# EAGLE design bluetooth (EAGLE 9.6.2)
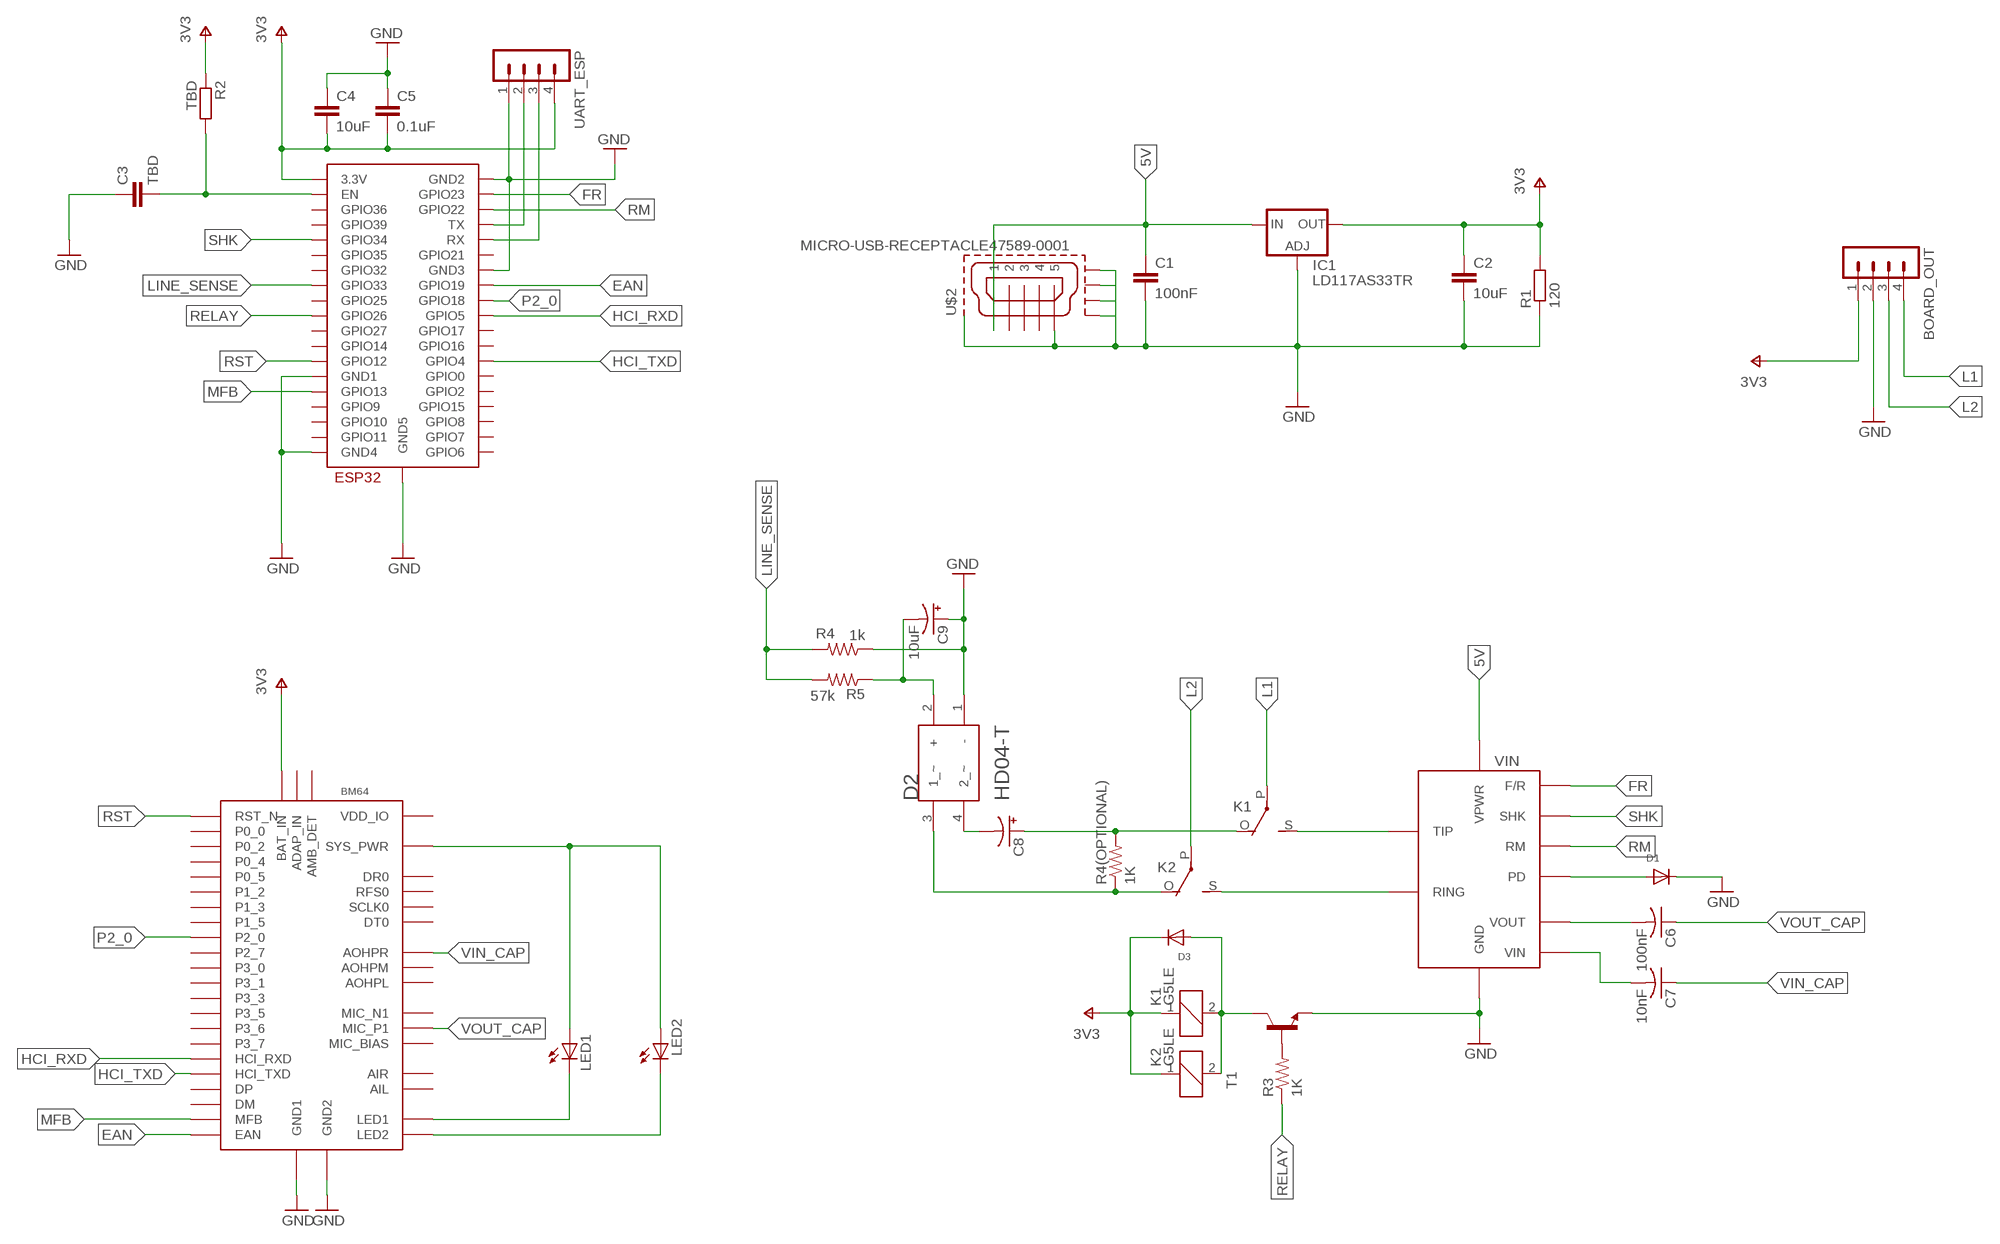
[diagram p0: schematic, sheet 1]

## Parts
BM64  DJD_EAGLE_LIBRARY_BM64  [DJD_EAGLE_LIBRARY_BM64]
BOARD_OUT  MA04-1  [MA04-1]
C1  100nF  C-EUC0805  [C0805]
C2  10uF  C-EUC0805  [C0805]
C3  TBD  C-EUC0805  [C0805]
C4  10uF  C-EUC0805  [C0805]
C5  0.1uF  C-EUC0805  [C0805]
C6  100nF  C-USC0805  [C0805]
C7  10nF  C-USC0805  [C0805]
C8  CPOL-USE2-5  [E2-5]
C9  10uF  10UF-POLAR-RADIAL-2.5MM-25V-20%  [CPOL-RADIAL-2.5MM-5MM]
D1  DIODESMA  [SMADIODE]
D2  DIODES_HD04-TDIODES_HD04-T_0_0  [DIODES_HD04-T_0]
D3  DIODESOD-123  [SOD-123]
IC1  LD117AS33TR  [SOT223]
K1  G5LE  [G5LE]
K2  G5LE  [G5LE]
LED1  LEDCHIP-LED0805  [CHIP-LED0805]
LED2  LEDCHIP-LED0805  [CHIP-LED0805]
R1  120  R-EU_M0805  [M0805]
R2  TBD  R-EU_M0805  [M0805]
R3  1K  R-US_M0805  [M0805]
R4  1k  R-US_M0805  [M0805]
R4(OPTIONAL)  1K  R-US_M0805  [M0805]
R5  57k  R-US_M0805  [M0805]
T1  -NPN-SOT23-EBC  [SOT23-EBC]
U$1  ESP32-WROOM  [ESP32-WROOM]
U$2  MICRO-USB-RECEPTACLE47589-0001  [47589-0001]
UART_ESP  MA04-1  [MA04-1]
VIN  DJD_EAGLE_LIBRARY_AG1171SIL  [DJD_EAGLE_LIBRARY_AG1171]

## Nets
5V: C1.1 IC1.3(IN) U$2.1 VIN.P$13(VPWR)
CRANK_LOAD_1: C8.+ K1.O(2:O) R4(OPTIONAL).2
CRANK_LOAD_2: D2.3(1_~) K2.O(2:O) R4(OPTIONAL).1
EAN: BM64.32(EAN) U$1.IO19(GPIO19)
ESP_EN: C3.2 R2.2 U$1.EN
ESP_RX: U$1.RX UART_ESP.3
ESP_TX: U$1.TX UART_ESP.2
FR: U$1.IO23(GPIO23) VIN.P$3(F/R)
GND: BM64.14(GND1) BM64.43(GND2) BOARD_OUT.2 C1.2 C2.2 C3.1 C4.1 C5.1 C9.1(+) D1.C D2.1(-) IC1.1(ADJ) R1.1 R4.1 T1.E U$1.GND1 U$1.GND2 U$1.GND3 U$1.GND4 U$1.GND5 U$2.5 U$2.CASING1(GND1) U$2.CASING2(GND2) U$2.CASING3(GND3) U$2.CASING4(GND4) UART_ESP.1 VIN.P$12(GND)
HCI_RXD: BM64.19(HCI_RXD) U$1.IO5(GPIO5)
HCI_TXD: BM64.20(HCI_TXD) U$1.IO4(GPIO4)
L1: BOARD_OUT.4 K1.P(2:P)
L2: BOARD_OUT.3 K2.P(2:P)
LED1: BM64.28(LED1) LED1.C
LED2: BM64.27(LED2) LED2.C
LINE_RELAY_1: K1.S(2:S) VIN.P$2(TIP)
LINE_RELAY_2: K2.S(2:S) VIN.P$1(RING)
LINE_SENSE: R4.2 R5.2 U$1.IO33(GPIO33)
MFB: BM64.26(MFB) U$1.IO13(GPIO13)
N$5: R3.2 T1.B
N$12: C8.- D2.4(2_~)
N$14: C9.2(-) D2.2(+) R5.1
P2_0: BM64.41(P2_0) U$1.IO18(GPIO18)
POWER_DOWN: D1.A VIN.P$14(PD)
RELAY: R3.1 U$1.IO26(GPIO26)
RELAY_DRIVE: D3.A K1.2 K2.2 T1.C
RM: U$1.IO22(GPIO22) VIN.P$4(RM)
RST: BM64.13(RST_N) U$1.IO12(GPIO12)
SHK: U$1.IO34(GPIO34) VIN.P$5(SHK)
SYS_PWR: BM64.24(SYS_PWR) LED1.A LED2.A
V+: BM64.22(BAT_IN) BOARD_OUT.1 C2.1 C4.2 C5.2 D3.C IC1.4(OUT) K1.1 K2.1 R1.2 R2.1 U$1.3V3(3.3V) UART_ESP.4 ; supply symbol labelled 3V3
VIN: C7.2 VIN.P$9(VIN)
VIN_CAP: BM64.5(AOHPR) C7.1
VOUT: C6.2 VIN.P$10(VOUT)
VOUT_CAP: BM64.9(MIC_P1) C6.1
Unconnected: BM64.1(DR0) BM64.2(RFS0) BM64.3(SCLK0) BM64.4(DT0) BM64.6(AOHPM) BM64.7(AOHPL) BM64.8(MIC_N1) BM64.10(MIC_BIAS) BM64.11(AIR) BM64.12(AIL) BM64.15(P1_2) BM64.16(P1_3) BM64.17(P0_4) BM64.18(P1_5) BM64.21(VDD_IO) BM64.25(AMB_DET) BM64.29(P3_7) BM64.30(P3_5) BM64.31(P0_0) BM64.33(DM) BM64.34(DP) BM64.35(P0_5) BM64.36(P3_0) BM64.37(P3_1) BM64.38(P3_3) BM64.39(P3_6) BM64.40(P0_2) BM64.42(P2_7) U$1.CLK(GPIO6) U$1.CMD(GPIO11) U$1.IO0(GPIO0) U$1.IO2(GPIO2) U$1.IO14(GPIO14) U$1.IO15(GPIO15) U$1.IO16(GPIO16) U$1.IO17(GPIO17) U$1.IO21(GPIO21) U$1.IO25(GPIO25) U$1.IO27(GPIO27) U$1.IO32(GPIO32) U$1.IO35(GPIO35) U$1.SD0(GPIO7) U$1.SD1(GPIO8) U$1.SD2(GPIO9) U$1.SD3(GPIO10) U$1.SENSOR_VN(GPIO39) U$1.SENSOR_VP(GPIO36) U$2.2 U$2.3 U$2.4

## Power pins joined to a net without a drawn wire
ADAP_IN: BM64.23(ADAP_IN)

## Library data of the parts
BM64 = blue_pot_proto:DJD_EAGLE_LIBRARY_BM64: Microchip BM64 Bluetooth Module
BOARD_OUT UART_ESP = con-lstb:MA04-1: PIN HEADER; OC_FARNELL: unknown; OC_NEWARK: unknown
C1-C5 = rcl:C-EU: CAPACITOR, European symbol; SPICEPREFIX: C
C6 C7 = adafruit:C-US: CAPACITOR, American symbol
C8 = adafruit:CPOL-US: POLARIZED CAPACITOR, American symbol
C9 = SparkFun-Capacitors:10UF-POLAR: 10.0µF polarized capacitors A capacitor is a passive two-terminal electrical component used to store electrical energy temporarily in an electric field.; PROD_ID: CAP-08440
D1 D3 = adafruit:DIODE: Diode SMADIODE - SMA Surface Mount Package 20V 1A Schottky Diode Digikey: 641-1014-6-ND DO-1N4148 - Through Hole Small Current Diode SOD-123 20V 1 A (.5mV Vf) Schottky Diode - Digikey: MBRX120TPMSCT-ND SOD-323 10V 570mA (.38mV Vf, 3ns) Schottky Diode - Digikey: ZLLS410CT-ND SOD-523 30V 30mA Schottky Diode (RB751S-40TE61) - Digikey: RB751S-40TE61CT-ND SOT23-R/W - SOT23 Package (R = Solder Paste/Reflow Ovens, W = Hand-Soldering) BAT54Film 40V 300mA - Digikey: 497-7162-1-ND
D2 = Diodes - HD04-T:DIODES_HD04-T: 0.8A SURFACE MOUNT GLASS PASSIVATED BRIDGE RECTIFIER; CENTROID_NOT_SPECIFIED: No; DATASHEET: https://www.diodes.com/assets/Datasheets/ds17003.pdf; DC_BLOCKING_VOLTAGE: 400V; DEVICE_CLASS_L1: Discrete Semiconductors; DEVICE_CLASS_L2: Diodes; DEVICE_CLASS_L3: Rectifier Diodes; DIGIKEY_DESCRIPTION: DIODE RECT BRIDGE GP 400V 0.8A MINIDIP; DIGIKEY_PART_NUMBER: HD04DICT-ND; FOOTPRINT_URL: https://www.diodes.com/assets/Package-Files/MiniDIP.pdf; FOOTPRINT_VARIANT_NAME_0: Recommended_Land_Pattern; FORWARD_CURRENT: 0.8A; HEIGHT: 3mm; LEAD_FREE: yes; MAX_REPETITIVE_REVERSE_VOLTAGE: 400V; MAX_SURGE_FORWARD_CURRENT: 30A; MF: Diodes; MFG_PACKAGE_IDENT: MiniDIP; MFG_PACKAGE_IDENT_DATE: 06/2017; MFG_PACKAGE_IDENT_REV: 0; MOUSER_DESCRIPTION: Bridge Rectifiers 400V 0.8A; MOUSER_PART_NUMBER: 621-HD04T; MPN: HD04-T; PACKAGE: MiniDIP-4; PEAK_REVERSE_CURRENT: 500uA; PREFIX: D; REVERSE_VOLTAGE: 280V; ROHS: yes; STANDOFF_HEIGHT: 0.2mm; TEMPERATURE_RANGE_HIGH: +150°C; TEMPERATURE_RANGE_LOW: -55°C; VERIFICATION_VERSION: 0.0.0.1; WORKING_REVERSE_VOLTAGE: 400V
IC1 = v-reg:LD117A?*: Low drop fixed and adjustable positive voltage regulators 1 A Source: http://www.st.com/stonline/products/literature/ds/7194/ld1117axx.pdf
K1 K2 = relay:G5LE: RELAY 1 x switch, 10 A/120 V AC, 8 A/30 V DC, Omron; OC_FARNELL: unknown; OC_NEWARK: unknown
LED1 LED2 = adafruit:LED: LED OSRAM: - CHIPLED LG R971, LG N971, LY N971, LG Q971, LY Q971, LO R971, LY R971 LH N974, LH R974 LS Q976, LO Q976, LY Q976 LO Q996 - Hyper CHIPLED LW Q18S LB Q993, LB Q99A, LB R99A - SideLED LS A670, LO A670, LY A670, LG A670, LP A670 LB A673, LV A673, LT A673, LW A673 LH A674 LY A675 LS A676, LA A676, LO A676, LY A676, LW A676 LS A679, LY A679, LG A679 - Hyper Micro SIDELED® LS Y876, LA Y876, LO Y876, LY Y876 LT Y87S - SmartLED LW L88C, LW L88S LB L89C, LB L89S, LG L890 LS L89K, LO L89K, LY L89K LS L896, LA L896, LO L896, LY L896 - TOPLED LS T670, LO T670, LY T670, LG T670, LP T670 LSG T670, LSP T670, LSY T670, LOP T670, LYG T670 LG T671, LOG T671, LSG T671 LB T673, LV T673, LT T673, LW T673 LH T674 LS T676, LA T676, LO T676, LY T676, LB T676, LH T676, LSB T676, LW T676 LB T67C, LV T67C, LT T67C, LS T67K, LO T67K, LY T67K, LW E67C LS E67B, LA E67B, LO E67B, LY E67B, LB E67C, LV E67C, LT E67C LW T67C LS T679, LY T679, LG T679 LS T770, LO T770, LY T770, LG T770, LP T770 LB T773, LV T773, LT T773, LW T773 LH T774 LS E675, LA E675, LY E675, LS T675 LS T776, LA T776, LO T776, LY T776, LB T776 LHGB T686 LT T68C, LB T68C - Hyper Mini TOPLED® LB M676 - Mini TOPLED Santana® LG M470 LS M47K, LO M47K, LY M47K Source: http://www.osram.convergy.de/
R1 R2 = rcl:R-EU_: RESISTOR, European symbol; SPICEPREFIX: R
R3 R4 R4(OPTIONAL) R5 = adafruit:R-US_: RESISTOR, American symbol
T1 = transistor:*-NPN-: NPN Transistror BF959 corrected 2008.03.06
U$1 = ESP32:ESP32-WROOM
U$2 = con-molex-usb:MICRO-USB-RECEPTACLE: MICRO USB RECEPTACLES Micro-USB Receptacles, SMT, Lead-Free from MOLEX <http://www.molex.com/>. (C) 2014 Tomasz Boleslaw CEDRO, cederom@tlen.pl, http://www.tomek.cedro.info. Version 0.1 (2014-01-17): Initial release. Version 0.2 (2014-02-06): Updated 47589-0001 footprint pins/pads/milling. Following devices are included: 1. 47589-0001 Micro-USB AB Receptacle, Bottom Mount, SMT, Lead-Free <http://www.molex.com/molex/products/datasheet.jsp?part=active/0475890001_IO_CONNECTORS.xml> (Technical Drawing <http://www.molex.com/pdm_docs/sd/475890001_sd.pdf>).
VIN = blue_pot_proto:DJD_EAGLE_LIBRARY_AG1171: Silvertel AG1171 +3.3V / +5.0V Low Power Ringing SLIC

## Net classes
0 default: width 0.381 mm
1 large: width 0.254 mm

## Board
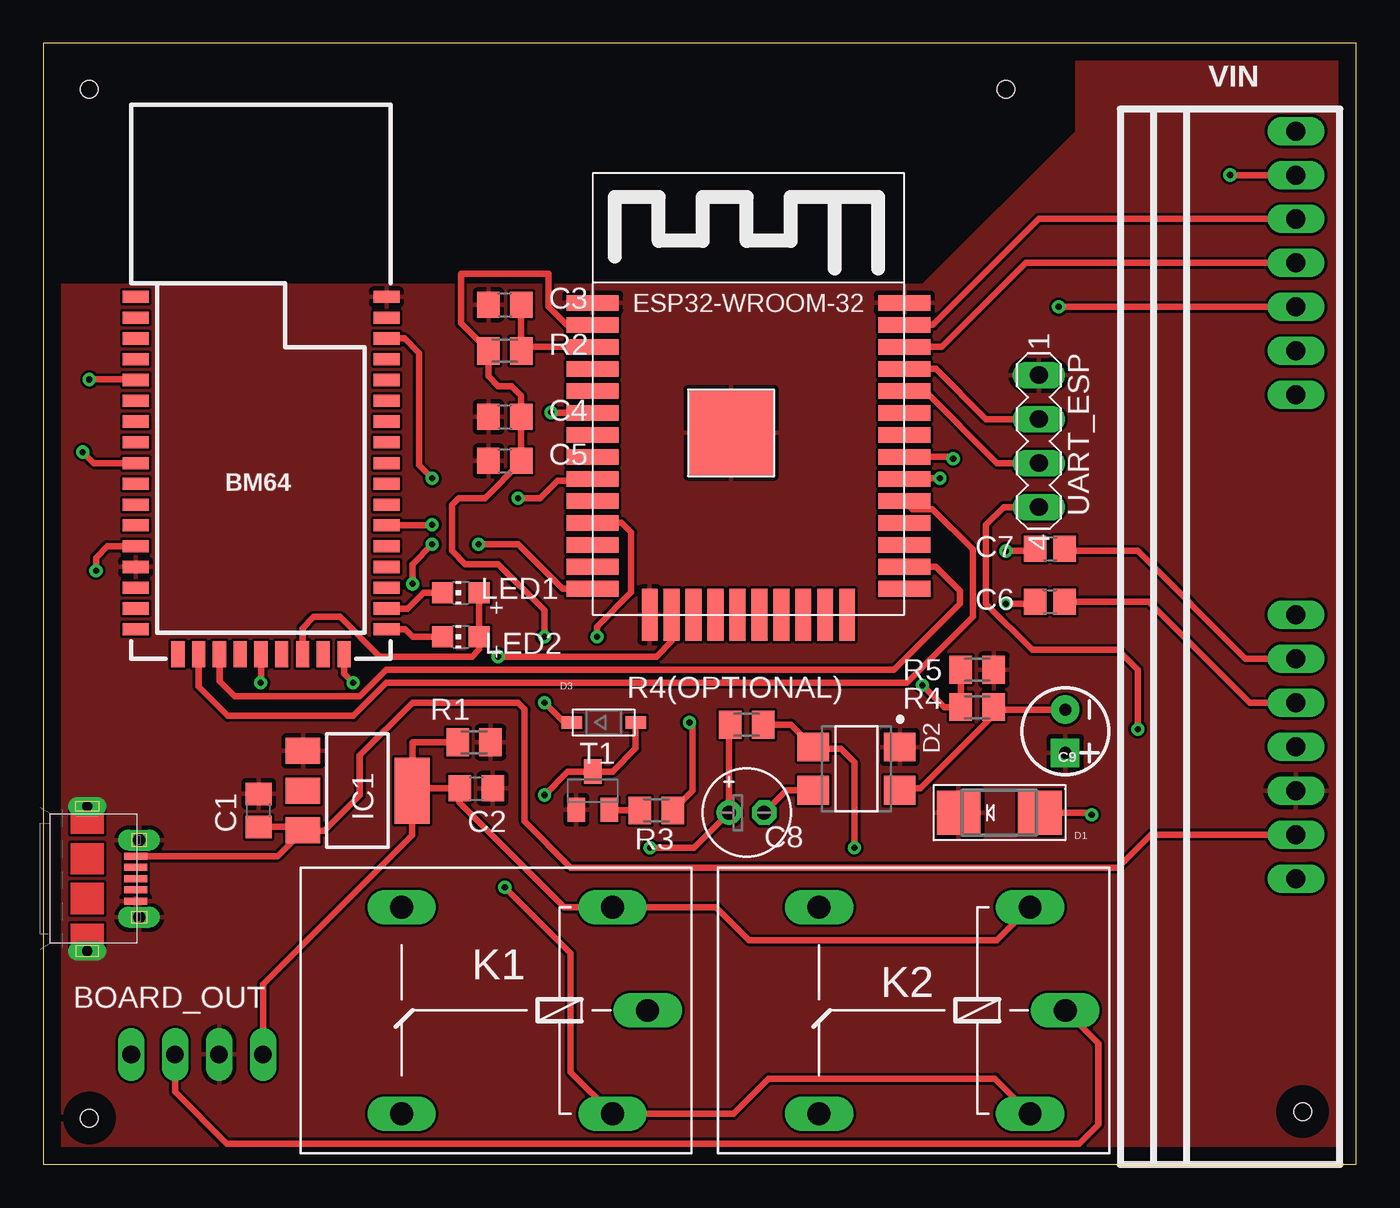
[diagram p1: board, top side]
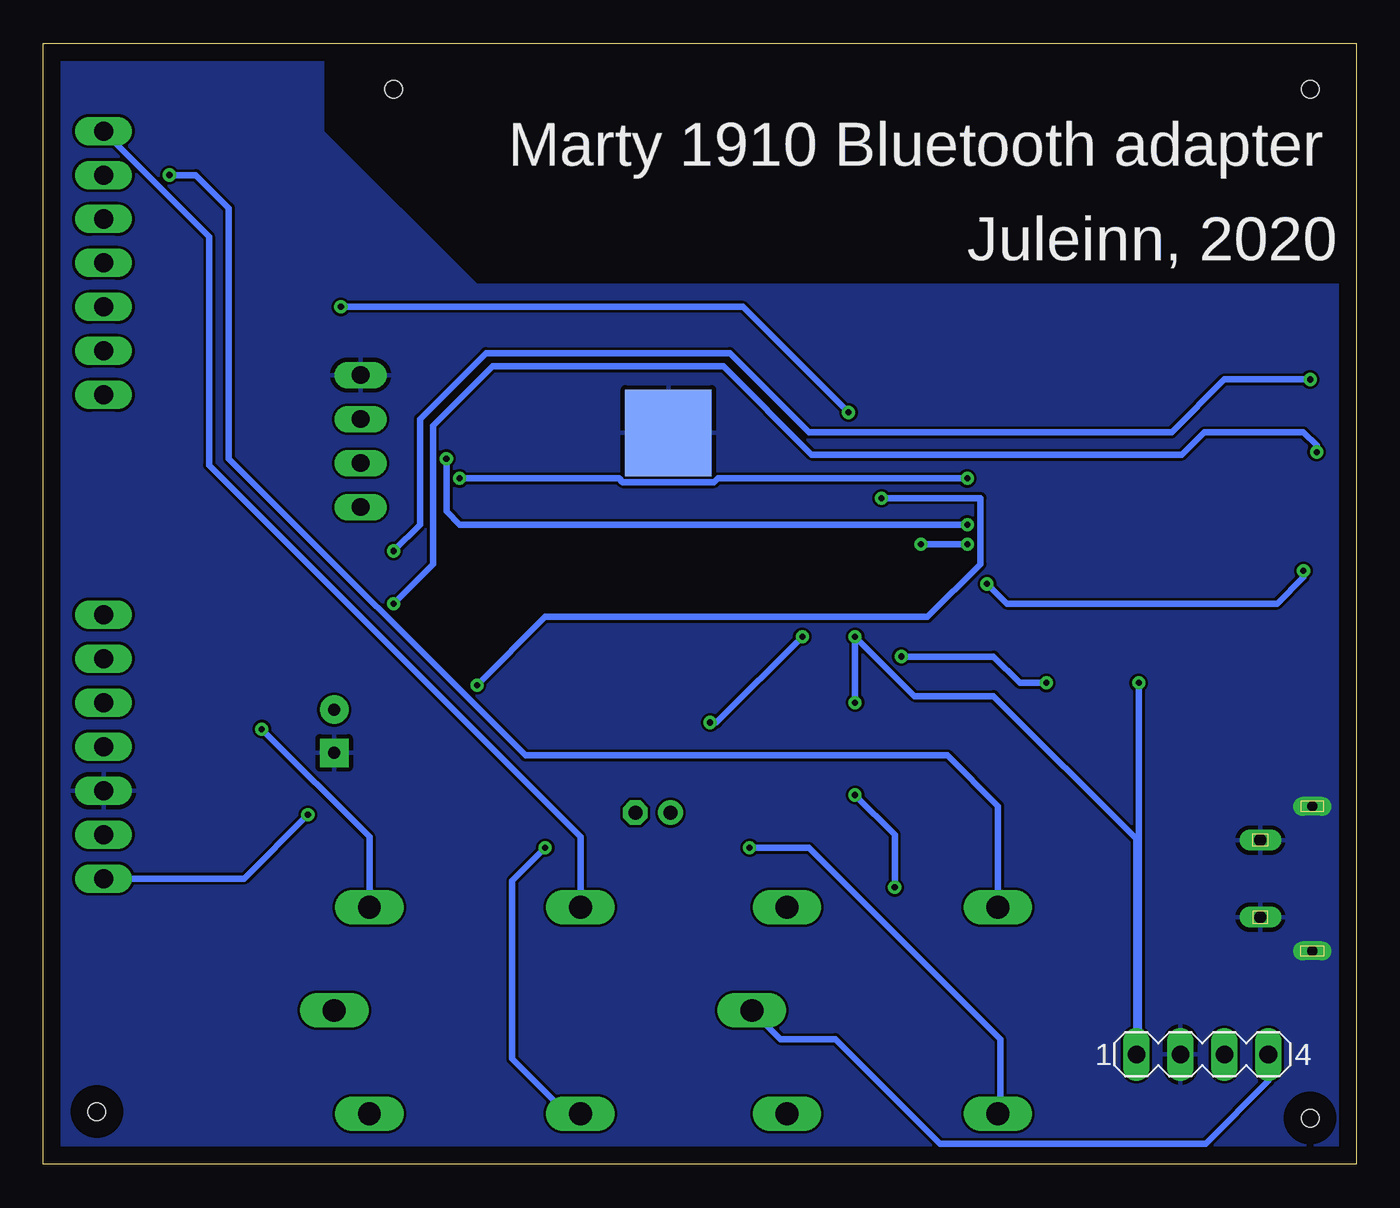
[diagram p2: board, bottom side, seen from below]

Size 75.87 x 64.76 mm. Coordinates in mm from the lower left corner, seen from the top.
Outline: 0,0 75.87,0 75.87,64.76 0,64.76 0,0
Copper layers (1*16): Top 0.035mm / dielectric 1.5mm / Bottom 0.035mm
Design rules "default": minimum track width 6mil, minimum drill 0.35mm, track to track 6mil, track to pad 6mil, pad to pad 6mil, via to via 6mil, smd to smd 6mil, copper to edge 40mil, drill to drill 6mil, minimum pad ring 10mil, minimum via ring 8mil, stop-mask expansion 4mil, vias tented up to drill 0mil, thermal gap 10mil
Holes 1 mm at 2.67,2.67 2.67,62.1 72.77,3.05 55.63,62.1

### Footprints (pad centres in the part's own frame; a part is rotated, then mirrored left to right if it is on the bottom)
DJD_EAGLE_LIBRARY_BM64 = smd 1.5 x 0.7: 1 0.25,20.9; 2 0.25,19.7; 3 0.25,18.5; 4 0.25,17.3; 5 0.25,16.1; 6 0.25,14.9; 7 0.25,13.7; 8 0.25,12.5; 9 0.25,11.3; 10 0.25,10.1; 11 0.25,8.9; 12 0.25,7.7; 13 0.25,6.5; 14 0.25,5.3; 15 0.25,4.1; 16 0.25,2.9; 17 0.25,1.7; 27 14.75,1.7; 28 14.75,2.9; 29 14.75,4.1; 30 14.75,5.3; 31 14.75,6.5; 32 14.75,7.7; 33 14.75,8.9; 34 14.75,10.1; 35 14.75,11.3; 36 14.75,12.5; 37 14.75,13.7; 38 14.75,14.9; 39 14.75,16.1; 40 14.75,17.3; 41 14.75,18.5; 42 14.75,19.7; 43 14.75,20.9 | smd 0.76 x 1.5: 18 2.7,0.25; 19 3.9,0.25; 20 5.1,0.25; 21 6.3,0.25; 22 7.5,0.25; 23 8.7,0.25; 24 9.9,0.25; 25 11.1,0.25; 26 12.3,0.25
MA04-1 = drill 1.016 long: 1 -3.81,0; 2 -1.27,0; 3 1.27,0; 4 3.81,0
C0805 = smd 1.3 x 1.5: 1 -0.95,0; 2 0.95,0
C0805' = smd 1.3 x 1.5: 1 -0.85,0; 2 0.85,0
E2-5 = drill 0.813 pad 1.422: + -1.016,0 | drill 0.813 pad 1.422 octagon: - 1.016,0
CPOL-RADIAL-2.5MM-5MM = drill 0.7 pad 1.651 square: 1 1.25,0 | drill 0.7 pad 1.651: 2 -1.25,0
SMADIODE = smd 2.54 x 2.54: A 2.349,0; C -2.349,0
DIODES_HD04-T_0 = smd 1.65 x 1.8: 1 -1.25,2.5; 2 1.25,2.5; 3 -1.25,-2.5; 4 1.25,-2.5
SOD-123 = smd 1.2 x 0.7: A 1.85,0; C -1.85,0
SOT223 = smd 1.5 x 2: 1 -2.3,-3.15; 2 0,-3.15; 3 2.3,-3.15 | smd 3.8 x 2: 4 0,3.15
G5LE = drill 1.321 long: 1 -7.493,-5.969; 2 -7.493,5.969; O 4.699,5.969; P -9.525,0; S 4.699,-5.969
CHIP-LED0805 = smd 1.2 x 1.2: A 0,-1.05; C 0,1.05
M0805 = smd 1.3 x 1.6: 1 -0.95,0; 2 0.95,0
SOT23-EBC = smd 1 x 1.4: B 0.95,-1.1; C 0,1.1; E -0.95,-1.1
ESP32-WROOM = smd 3 x 0.9: 3V3 0,16.74; EN 0,15.47; GND1 0,18.01; GND3 18,18.01; IO0 18,1.5; IO4 18,2.77; IO5 18,6.58; IO12 0,1.5; IO14 0,2.77; IO16 18,4.04; IO17 18,5.31; IO18 18,7.85; IO19 18,9.12; IO21 18,11.66; IO22 18,15.47; IO23 18,16.74; IO25 0,6.58; IO26 0,5.31; IO27 0,4.04; IO32 0,9.12; IO33 0,7.85; IO34 0,11.66; IO35 0,10.39; NC 18,10.39; RX 18,12.93; SENSOR_VN 0,12.93; SENSOR_VP 0,14.2; TX 18,14.2 | smd 0.9 x 3: CLK 9.635,0; CMD 8.365,0; GND2 3.285,0; IO2 14.715,0; IO13 4.555,0; IO15 13.445,0; SD0 10.905,0; SD1 12.175,0; SD2 5.825,0; SD3 7.095,0 | smd 5 x 5: GND4 8,10.5 | smd 5 x 5 bottom: GND5 8,10.5
47589-0001 = smd 1.35 x 0.4: 1 2.8,1.3; 2 2.8,0.65; 3 2.8,0; 4 2.8,-0.65; 5 2.8,-1.3 | drill 0.6 pad 0.95 long: CASING1 0,4.175; CASING2 0,-4.175 | drill 0.7 pad 1.1 long: CASING3 3,2.225; CASING4 3,-2.225
DJD_EAGLE_LIBRARY_AG1171 = drill 1.1 long: P$1 0,30.48; P$2 0,27.94; P$3 0,25.4; P$4 0,22.86; P$5 0,20.32; P$6 0,17.78; P$7 0,15.24; P$8 0,2.54; P$9 0,0; P$10 0,-2.54; P$11 0,-5.08; P$12 0,-7.62; P$13 0,-10.16; P$14 0,-12.7

### Placement (x,y rotation side)
BM64  5.08,29.21 0 top
BOARD_OUT  8.89,6.35 0 bottom
C1  12.45,20.45 90 top
C2  25.02,21.72 0 top
C3  26.67,49.66 0 top
C4  26.67,43.18 0 top
C5  26.67,40.64 0 top
C6  100nF  [C0805']  58.17,32.51 0 top
C7  10nF  [C0805']  58.17,35.56 0 top
C8  40.64,20.32 0 top
C9  59.05,25.02 270 top
D1  55.24,20.32 0 top
D2  46.99,22.86 270 top
D3  32.38,25.53 0 top
IC1  18.16,21.59 270 top
K1  25.4,8.89 180 top
K2  49.53,8.89 180 top
LED1  24.13,33.02 90 top
LED2  24.13,30.48 90 top
R1  24.89,24.38 180 top
R2  26.67,46.99 0 top
R3  35.43,20.45 180 top
R4  53.98,28.57 180 top
R4(OPTIONAL)  40.64,25.4 180 top
R5  53.98,26.42 180 top
T1  31.75,21.59 0 top
U$1  31.75,31.75 0 top
U$2  2.54,16.51 0 top
UART_ESP  57.53,41.78 270 top
VIN  72.39,29.21 0 top

### Tracks (layer width: path | path; a pad name or v marks a point on that pad's centre or on a via)
5V
  Top 0.381: U$2.1 13.53,17.81 IC1.3 | IC1.3 | IC1.3 16.24,19.29 18.29,21.34 18.29,23.62 21.34,26.67 27.43,26.67 27.81,26.29 27.81,19.81 30.48,17.14 62.1,17.14 64.01,19.05 VIN.P$13 | C1.1 14.79,19.5 IC1.3
CRANK_LOAD_1  (via drill 0.35)
  Top 0.381: R4(OPTIONAL).2 39.62,25.33 C8.+ 37.59,18.29 v35.05,18.29
  Bottom 0.381: K1.O 20.57,3.05 20.57,7.24 31.62,18.29 v35.05,18.29
CRANK_LOAD_2  (via drill 0.35)
  Top 0.381: R4(OPTIONAL).1 43.2,25.4 D2.3 44.6,24 46.1,24 46.86,23.24 v46.86,18.29
  Bottom 0.381: v46.86,18.29 48.77,16.38 48.77,6.1 45.59,2.92 K2.O
EAN  (via drill 0.35)
  Top 0.381: U$1.IO19 52.48,40.87 v52.58,40.77 | v22.48,36.96 22.43,36.91 BM64.32
  Bottom 0.381: v52.58,40.77 52.58,37.72 51.82,36.96 v22.48,36.96
ESP_EN
  Top 0.381: C3.2 R2.2 27.85,47.22 U$1.EN
ESP_RX
  Top 0.381: U$1.RX 50.95,44.68 55.12,40.51 UART_ESP.3
ESP_TX
  Top 0.381: U$1.TX 51.59,45.95 54.48,43.05 UART_ESP.2
FR
  Top 0.381: VIN.P$3 57.53,54.61 51.41,48.49 U$1.IO23
GND
  pour Top: 0,50.8 50.8,50.8 59.69,59.69 59.69,64.77 76.2,64.77 76.2,0 0,0
  pour Bottom: 0,50.8 0,0 76.2,0 76.2,64.77 59.69,64.77 59.69,59.69 50.8,50.8
HCI_RXD
  Top 0.381: U$1.IO5 50.23,37.85 51.39,37.85 53.72,35.52 53.72,31.62 49.91,27.81 19.81,27.81 17.91,25.91 10.67,25.91 8.98,27.6 BM64.19
HCI_TXD
  Top 0.381: U$1.IO4 51.59,34.52 52.96,33.15 52.96,32.38 49.15,28.57 19.81,28.57 18.29,27.05 11.05,27.05 10.18,27.92 BM64.20
L1
  Bottom 0.381: K1.P 33.27,7.24 30.1,7.24 24.07,1.21 8.7,1.21 5.08,4.83 BOARD_OUT.4
L2
  Top 0.381: K2.P 60.96,6.99 60.96,2.29 59.88,1.21 10.6,1.21 7.62,4.19 BOARD_OUT.3
LED1
  Top 0.381: BM64.28 21.06,32.11 21.97,33.02 LED1.C
LED2
  Top 0.381: BM64.27 20.91,30.91 21.34,30.48 LED2.C
LINE_RELAY_1  (via drill 0.35)
  Top 0.381: VIN.P$2 v68.58,57.15
  Bottom 0.381: v68.58,57.15 67.06,57.15 65.15,55.24 65.15,40.77 48.01,23.62 23.62,23.62 20.7,20.7 K1.S
LINE_RELAY_2
  Bottom 0.381: VIN.P$1 66.29,53.59 66.29,40.39 44.83,18.92 K2.S
LINE_SENSE  (via drill 0.35)
  Top 0.381: R4.2 R5.2 52.07,26.42 v50.8,27.68 | U$1.IO33 31.65,39.5 29.73,39.5 28.7,38.48 v27.43,38.48
  Bottom 0.381: v50.8,27.68 46.86,31.62 24.77,31.62 21.72,34.67 21.72,38.48 v27.43,38.48
MFB  (via drill 0.35)
  Top 0.381: U$1.IO13 36.3,30.21 35.43,29.34 v26.29,29.34 | v17.91,27.81 17.38,28.34 BM64.26
  Bottom 0.381: v17.91,27.81 19.43,27.81 20.95,29.34 v26.29,29.34
N$5
  Top 0.381: R3.2 32.74,20.45 T1.B
N$12
  Top 0.381: C8.- 42.95,21.61 D2.4
N$14
  Top 0.381: D2.2 49.6,21.72 50.67,21.72 54.92,25.97 R5.1 55.07,26.27 C9.2
P2_0  (via drill 0.35)
  Top 0.381: U$1.IO18 49.77,39.62 v51.82,39.62 | v22.48,39.62 21.72,40.39 21.72,46.86 20.87,47.71 BM64.41
  Bottom 0.381: v51.82,39.62 42.61,39.62 42.39,39.41 37.11,39.41 36.89,39.62 v22.48,39.62
POWER_DOWN  (via drill 0.35)
  Top 0.381: D1.A 60.45,20.32 v60.58,20.19
  Bottom 0.381: v60.58,20.19 64.26,16.51 VIN.P$14
RELAY  (via drill 0.35)
  Top 0.381: v37.34,25.53 37.53,25.34 37.53,21.59 R3.1 | v32,30.48 32,31.07 33.97,33.04 33.97,36.51 33.42,37.06 U$1.IO26
  Bottom 0.381: v32,30.48 36.96,25.53 v37.34,25.53
RELAY_DRIVE  (via drill 0.35)
  Top 0.381: v26.67,16 30.48,12.19 30.48,5.33 K1.2 39.88,2.92 41.91,4.95 54.99,4.95 K2.2 | v28.96,21.34 30.31,22.69 T1.C | T1.C 31.92,22.86 | T1.C 32.89,22.69 34.23,24.03 D3.A
  Bottom 0.381: v26.67,16 26.67,19.05 v28.96,21.34
RM
  Top 0.381: VIN.P$4 56.77,52.07 51.92,47.22 U$1.IO22
RST  (via drill 0.35)
  Top 0.381: U$1.IO12 30,33.25 27.43,35.81 v25.15,35.81 | v22.48,35.81 21.34,34.67 v21.34,33.53 | v3.05,34.29 3.05,35.05 3.71,35.71 BM64.13
  Bottom 0.381: v25.15,35.81 v22.48,35.81 | v21.34,33.53 20.19,32.38 4.57,32.38 3.05,33.91 v3.05,34.29
SHK  (via drill 0.35)
  Top 0.381: U$1.IO34 29.36,43.41 v29.34,43.43 | v58.67,49.53 VIN.P$5
  Bottom 0.381: v29.34,43.43 35.43,49.53 v58.67,49.53
SYS_PWR
  Top 0.381: LED1.A LED2.A 25.18,29.75 24.77,29.34 19.43,29.34 17.14,31.62 15.62,31.62 14.98,30.98 BM64.24
V+  (via drill 0.35)
  Top 0.381: U$1.3V3 30.25,48.49 29.21,49.53 29.21,51.44 24.13,51.44 24.13,48.58 R2.1 25.72,45.53 26.29,44.96 27.05,44.96 27.62,44.39 C4.2 C5.2 27.62,40.57 25.53,38.48 24,38.48 23.62,38.1 23.62,35.43 24.38,34.67 26.29,34.67 28.96,32 v28.96,30.48 | IC1.4 21.44,21.72 C2.1 24.07,20.89 30.1,14.86 K1.1 38.86,14.86 40.77,12.95 55.12,12.95 K2.1 | IC1.4 21.34,21.61 21.34,24.38 R1.2 | IC1.4 21.31,19.02 12.7,10.41 BOARD_OUT.1 | BM64.22 v12.58,27.82 v12.57,27.81 | UART_ESP.4 55.5,37.97 54.48,36.96 54.48,32.38 57.15,29.72 62.1,29.72 63.25,28.57 v63.25,25.15 | v28.96,26.67 30.1,25.53 D3.C
  Bottom 0.381: v12.57,27.81 12.57,6.48 BOARD_OUT.1 12.7,18.8 20.95,27.05 25.53,27.05 v28.96,30.48 v28.96,26.67 | v63.25,25.15 57.02,18.92 K2.1
VIN
  Top 0.381: C7.2 59.14,35.43 63.25,35.43 69.47,29.21 VIN.P$9
VIN_CAP  (via drill 0.35)
  Top 0.381: C7.1 57.19,35.43 v55.63,35.43 | v2.67,45.34 5.3,45.34 BM64.5
  Bottom 0.381: v55.63,35.43 54.1,36.96 54.1,43.05 50.29,46.86 36.2,46.86 31.62,42.29 10.67,42.29 7.62,45.34 v2.67,45.34
VOUT
  Top 0.381: C6.2 63.88,32.51 69.72,26.67 VIN.P$10
VOUT_CAP  (via drill 0.35)
  Top 0.381: C6.1 57.19,32.38 v55.63,32.38 | v2.29,41.15 2.92,40.51 BM64.9
  Bottom 0.381: v55.63,32.38 53.34,34.67 53.34,42.67 49.91,46.1 36.58,46.1 31.47,41 10.07,41 8.77,42.29 3.05,42.29 2.29,41.53 v2.29,41.15

### Text on the board
bNames: Marty 1910 Bluetooth adapter | Juleinn, 2020